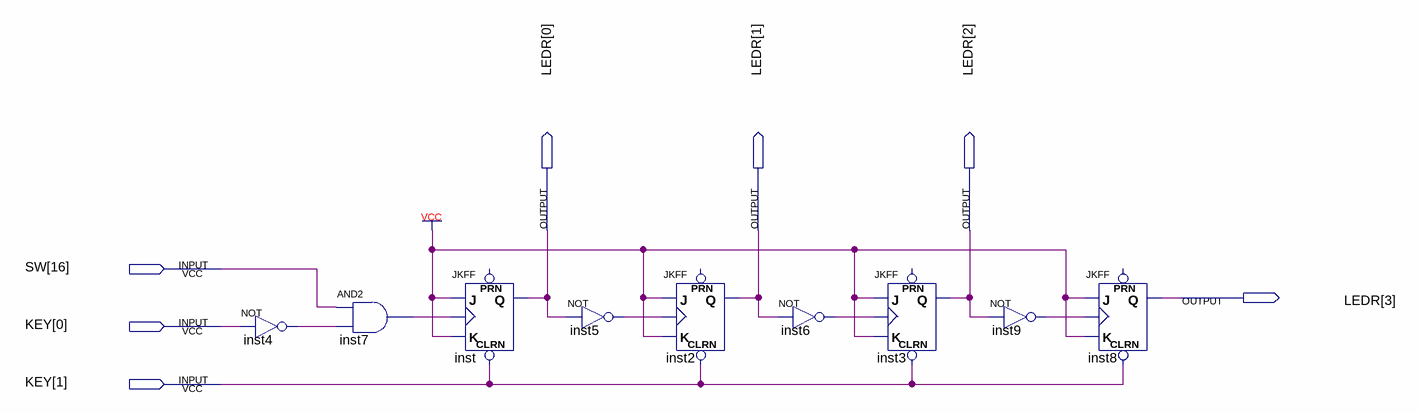
[diagram p0: schematic sheet]
// Quartus schematic citac.bdf as structural Verilog: 9 symbols, 7 pins
module citac (
  input  [16:16] SW,
  input  [1:0] KEY,
  output [3:0] LEDR
);

  wire inst4_out, inst5_out, inst6_out, inst7_out, inst9_out;

  not inst4 (inst4_out, KEY[0]);
  and inst7 (inst7_out, SW[16], inst4_out);
  JKFF inst (.CLRN(KEY[1]), .K(1'b1), .J(1'b1), .CLK(inst7_out), .Q(LEDR[0]));  // open: PRN
  not inst5 (inst5_out, LEDR[0]);
  JKFF inst2 (.CLRN(KEY[1]), .K(1'b1), .J(1'b1), .CLK(inst5_out), .Q(LEDR[1]));  // open: PRN
  not inst6 (inst6_out, LEDR[1]);
  JKFF inst3 (.CLRN(KEY[1]), .K(1'b1), .J(1'b1), .CLK(inst6_out), .Q(LEDR[2]));  // open: PRN
  not inst9 (inst9_out, LEDR[2]);
  JKFF inst8 (.CLRN(KEY[1]), .K(1'b1), .J(1'b1), .CLK(inst9_out), .Q(LEDR[3]));  // open: PRN
endmodule
